# Altium schematic sheet INT_REG.SchDoc
size A4; SheetNumber: 11; SheetTotal: 19
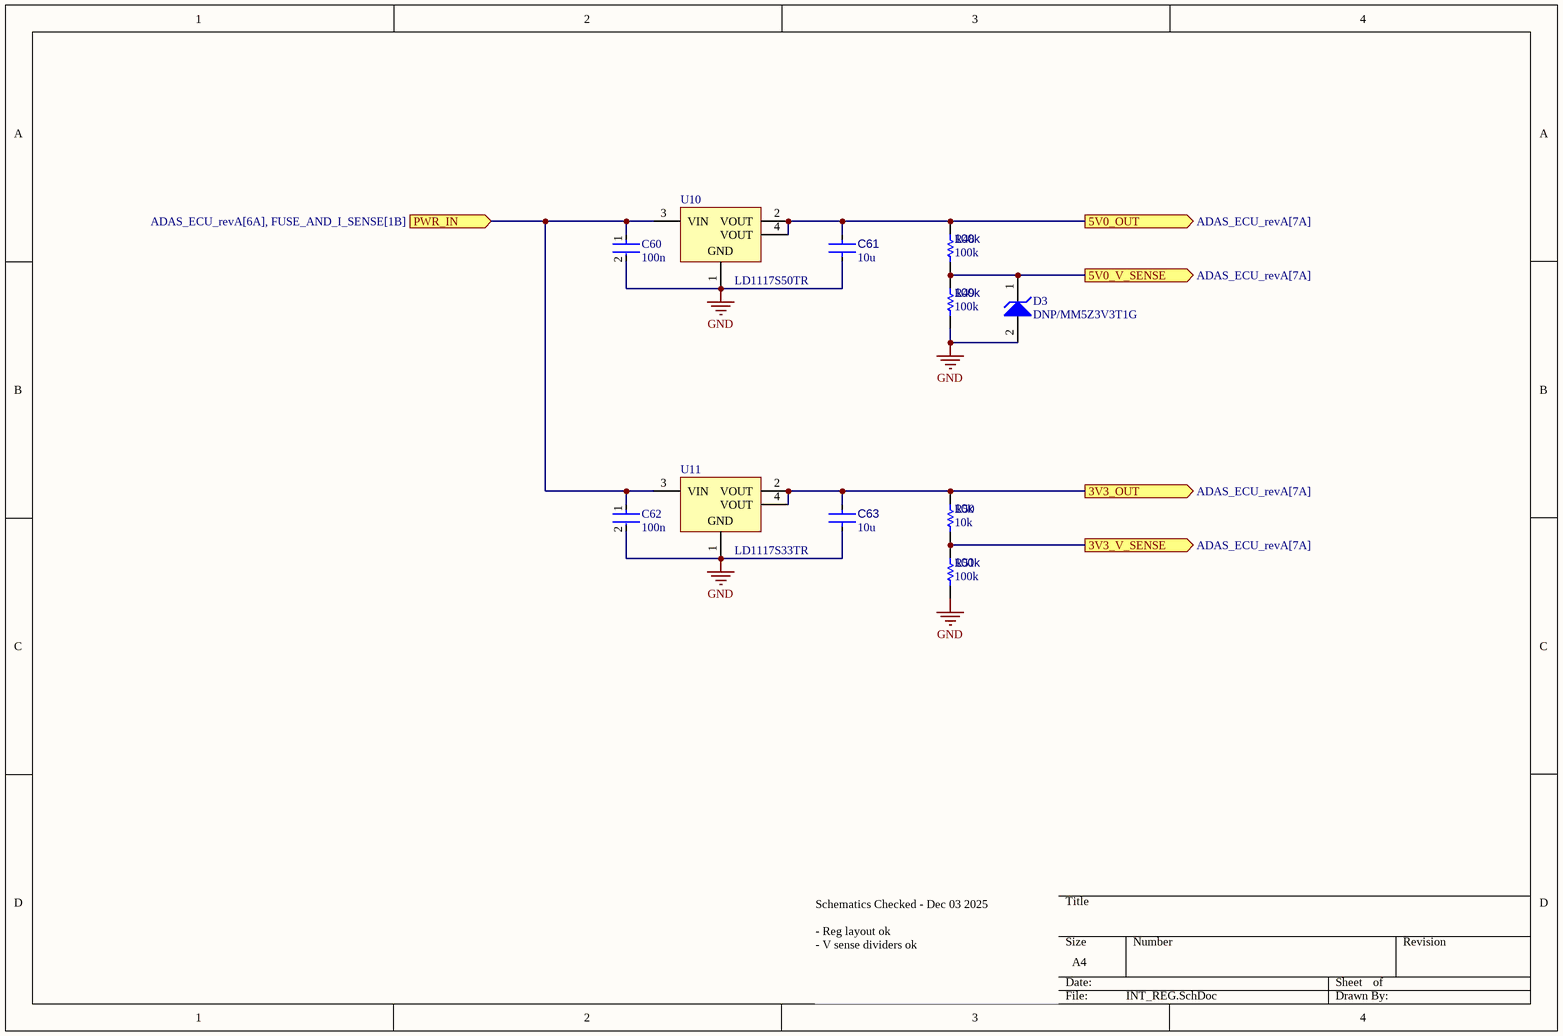
[diagram p0: INT_REG.SchDoc]

## Parts
C60  100n  [FP-0402-L_1_0_0_05-W_0_5-IPC_A]
C61  10u  [C0805A]
C62  100n  [FP-0402-L_1_0_0_05-W_0_5-IPC_A]
C63  10u  [C0805A]
D3  DNP/MM5Z3V3T1G  [ONSC-SOD-523-2-502-01_V]
R48  100k  [R0603B]
R49  100k  [R0603B]
R50  10k  [R0603B]
R51  100k  [R0603B]
U10  LD1117S50TR  [SOT-223_L]
U11  LD1117S33TR  [SOT-223_L]

## Ports
3V3_OUT (out, see ADAS_ECU_revA[7A]), 3V3_V_SENSE (out, see ADAS_ECU_revA[7A]), 5V0_OUT (out, see ADAS_ECU_revA[7A]), 5V0_V_SENSE (out, see ADAS_ECU_revA[7A]), PWR_IN (in, see ADAS_ECU_revA[6A], FUSE_AND_I_SENSE[1B])

## Nets
GND: C60.2 C61.2 C62.2 C63.2 D3.2(A) R49.2 R51.2 U10.1(GND) U11.1(GND)
3V3_OUT: C63.1 R50.1 U11.2(VOUT) U11.4(VOUT) ; port 3V3_OUT
3V3_V_SENSE: R50.2 R51.1 ; port 3V3_V_SENSE
5V0_OUT: C61.1 R48.1 U10.2(VOUT) U10.4(VOUT) ; port 5V0_OUT
5V0_V_SENSE: D3.1(K) R48.2 R49.1 ; port 5V0_V_SENSE
PWR_IN: C60.1 C62.1 U10.3(VIN) U11.3(VIN) ; port PWR_IN

## Notes on the sheet
- Schematics Checked - Dec 03 2025
  - Reg layout ok
  - V sense dividers ok

## Library data of the parts
C60 C62 = CMP-001-00058-1: LARGE PADS, 0402 CAP, CHANGE COMMENT TO MATCH REAL P/N; Capacitor Type: Ceramic; Min Operating Temperature: -55°C; Mounting Technology: Surface Mount; Pins: 2; Case/Package: 0402; RoHS Compliant: Yes; Max Operating Temperature: 85°C
C61 C63 = CMP-001-00000-11: Non-polarized capacitor
D3 = CMP-1060-00750-1: Zener Voltage Regulator, 500 mW, 2-Pin SOD-523, Pb-Free, Tape and Reel; Manufacturer: On Semiconductor; P Max (W): 0.5; VZ Typ (V): 3.3; RoHS: Pb-Free; ComponentLink2Description: Datasheet; PackageReference: SOD-523-2-502-01; DatasheetVersion: Rev. 10; ComponentLink1Description: Manufacturer URL; PackageVersion: Rev. E, 09/2010; ComponentLink3URL: http://www.onsemi.com/pub_link/Collateral/502-01.PDF; ComponentLink2URL: http://www.onsemi.cn/pub_link/Collateral/MM5Z2V4T1-D.PDF; Mounting Technology: Surface Mount; PartNumber: MM5Z3V3T1G; Packing: Tape and Reel; PackageDescription: 2-Pin SOD, Body 1.2 x 0.8 mm; ComponentLink1URL: http://www.onsemi.com/; ComponentLink3Description: Package Specification
R48-R51 = CMP-009-00002-14: Resistor
  R48 R49 R51: Value: 100k
  R50: Value: 10k
U10 = CMP-0244-00312-1: Fixed Low Drop Positive Voltage Regulator, 5V, 4-Pin SOT-223, Tape and Reel; ComponentLink1URL: http://www.st.com; DatasheetVersion: 1/11/2011; PackageDescription: 4-Pin SOT-223 Package, 6.5 x 3.5 mm Body, 2.3 mm Pitch, 7 mm Lead Span; ComponentLink2URL: http://www.st.com/internet/com/TECHNICAL_RESOURCES/TECHNICAL_LITERATURE/DATASHEET/CD00000544.pdf; ComponentLink1Description: Manufacturer URL; PackageReference: SOT-223; PackageVersion: 2010; ComponentLink2Description: Datasheet
U11 = CMP-0244-00310-1: Fixed Low Drop Positive Voltage Regulator, 3.3V, 4-Pin SOT-223, Tape and Reel; ComponentLink2Description: Datasheet; PackageDescription: 4-Pin SOT-223 Package, 6.5 x 3.5 mm Body, 2.3 mm Pitch, 7 mm Lead Span; PackageVersion: 2010; ComponentLink2URL: http://www.st.com/internet/com/TECHNICAL_RESOURCES/TECHNICAL_LITERATURE/DATASHEET/CD00000544.pdf; PackageReference: SOT-223; DatasheetVersion: 1/11/2011; ComponentLink1Description: Manufacturer URL; ComponentLink1URL: http://www.st.com